# EAGLE design control-bridge (EAGLE 6.6.0)
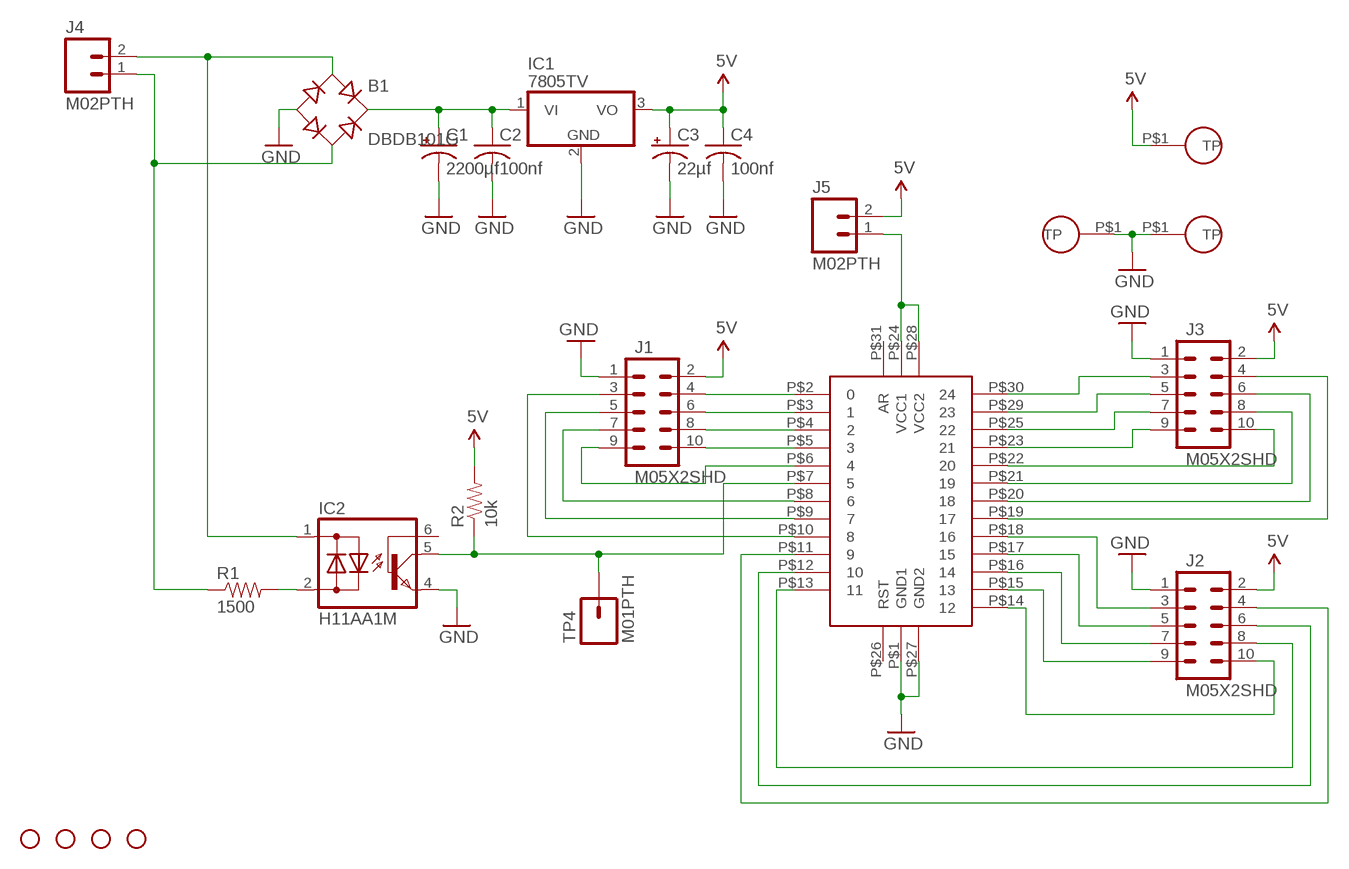
[diagram p0: schematic, sheet 1]

## Parts
B1  DBDB101G  [DB]
C1  2200µf  CPOL-USE5-13  [E5-13]
C2  100nf  C-US025-030X050  [C025-030X050]
C3  22µf  CPOL-USE5-8.5  [E5-8,5]
C4  100nf  C-US025-030X050  [C025-030X050]
IC1  7805TV  [TO220V]
IC2  H11AA1M  [DIL06]
J1  M05X2SHD  [2X5-SHROUDED]
J2  M05X2SHD  [2X5-SHROUDED]
J3  M05X2SHD  [2X5-SHROUDED]
J4  M02PTH  [1X02]
J5  M02PTH  [1X02]
R1  1500  RESISTORPTH-1/4W  [AXIAL-0.4]
R2  10k  RESISTORPTH-1/4W  [AXIAL-0.4]
STANDOFF1  STAND-OFF  [STAND-OFF]
STANDOFF2  STAND-OFF  [STAND-OFF]
STANDOFF3  STAND-OFF  [STAND-OFF]
STANDOFF4  STAND-OFF  [STAND-OFF]
TP1  TP  [TP]
TP2  TP  [TP]
TP3  TP  [TP]
TP4  M01PTH  [1X01]
U1  TEENSY2  [TEENSY2]

## Nets
5V: C3.+ C4.1 IC1.3(VO) J1.2 J2.2 J3.2 J5.2 R2.P$2 TP1.P$1(TP)
GND: B1.- C1.- C2.2 C3.- C4.2 IC1.2(GND) IC2.4(E) J1.1 J2.1 J3.1 TP2.P$1(TP) TP3.P$1(TP) U1.P$1(GND1) U1.P$27(GND2)
N$1: B1.AC2 J4.1 R1.P$1
N$2: B1.AC1 IC2.1(AC1) J4.2
N$3: B1.+ C1.+ C2.1 IC1.1(VI)
N$4: J3.8 U1.P$21
N$5: J3.6 U1.P$20
N$6: J1.4 U1.P$2
N$7: J1.6 U1.P$3
N$8: IC2.5(C) R2.P$1 TP4.1 U1.P$7
N$9: J3.4 U1.P$19
N$10: J2.3 U1.P$18
N$11: J1.8 U1.P$4
N$12: J1.10 U1.P$5
N$13: J5.1 U1.P$24(VCC1) U1.P$28(VCC2)
N$14: IC2.2(AC2) R1.P$2
N$16: J1.9 U1.P$6
N$17: J1.7 U1.P$8
N$19: J2.5 U1.P$17
N$20: J2.7 U1.P$16
N$21: J1.5 U1.P$9
N$22: J1.3 U1.P$10
N$23: J3.3 U1.P$30
N$24: J2.9 U1.P$15
N$25: J2.10 U1.P$14
N$26: J3.5 U1.P$29
N$27: J3.7 U1.P$25
N$28: J3.9 U1.P$23
N$29: J3.10 U1.P$22
N$30: J2.8 U1.P$13
N$31: J2.6 U1.P$12
N$32: J2.4 U1.P$11
Unconnected: IC2.6(B) U1.P$26(RST) U1.P$31(AR)

## Library data of the parts
B1 = rectifier:DB?*G: Single Phase 1.0 AMP Glass Passivated Bridge Rectifier Taiwan Semiconductor Co.,Ltd. - TSC Source: http://www.taiwansemi.com/TSCbig5/ezcatfiles/cust/img/img/db101g.pdf http://www.ts.com.tw/db/pictures/modules/PDT/PDT060207001/DBLS201G.pdf
C1 C3 = adafruit:CPOL-US: POLARIZED CAPACITOR, American symbol
C2 C4 = adafruit:C-US: CAPACITOR, American symbol
IC1 = linear:78*: Positive VOLTAGE REGULATOR Source: http://cache.national.com/ds/LM/LM78L05.pdf http://www.fairchildsemi.com/ds/LM/LM7805.pdf
IC2 = bodger:H11AA1M: Fairchild optocoupler; MF: Fairchild; MPN: H11AA1M; OC_DIGIKEY: H11AA1M-ND
J1-J3 = bodger:M05X2: Header 5x2 Standard 10-pin dual row 0.1" header. Commonly used with AVR-ISP. Use with Spark Fun Electronics SKU: PRT-00778
J4 J5 = SparkFun-Connectors:M02: Standard 2-pin 0.1" header. Use with - straight break away headers ( PRT-00116) - right angle break away headers (PRT-00553) - swiss pins (PRT-00743) - machine pins (PRT-00117) - female headers (PRT-00115) Molex polarized connector foot print use with: PRT-08233 with associated crimp pins and housings. 2.54_SCREWTERM for use with PRT-10571. 3.5mm Screw Terminal footprints for PRT-08084 5mm Screw Terminal footprints for use with PRT-08433
R1 R2 = SparkFun-Passives:RESISTOR: Resistor Basic schematic elements and footprints for 0603, 1206, and PTH resistors.
STANDOFF1-STANDOFF4 = SparkFun-Electromechanical:STAND-OFF: #4 Stand Off This is the mechanical footprint for a #4 phillips button head screw. Use the keepout ring to avoid running the screw head into surrounding components. SKU : PRT-00447
TP1-TP3 = bodger:TP
TP4 = SparkFun-Connectors:M01: Header 1 Standard 1-pin 0.1" header. Use with straight break away headers (SKU : PRT-00116), right angle break away headers (PRT-00553), swiss pins (PRT-00743), machine pins (PRT-00117), and female headers (PRT-00115).
U1 = bodger:TEENSY2

## Board
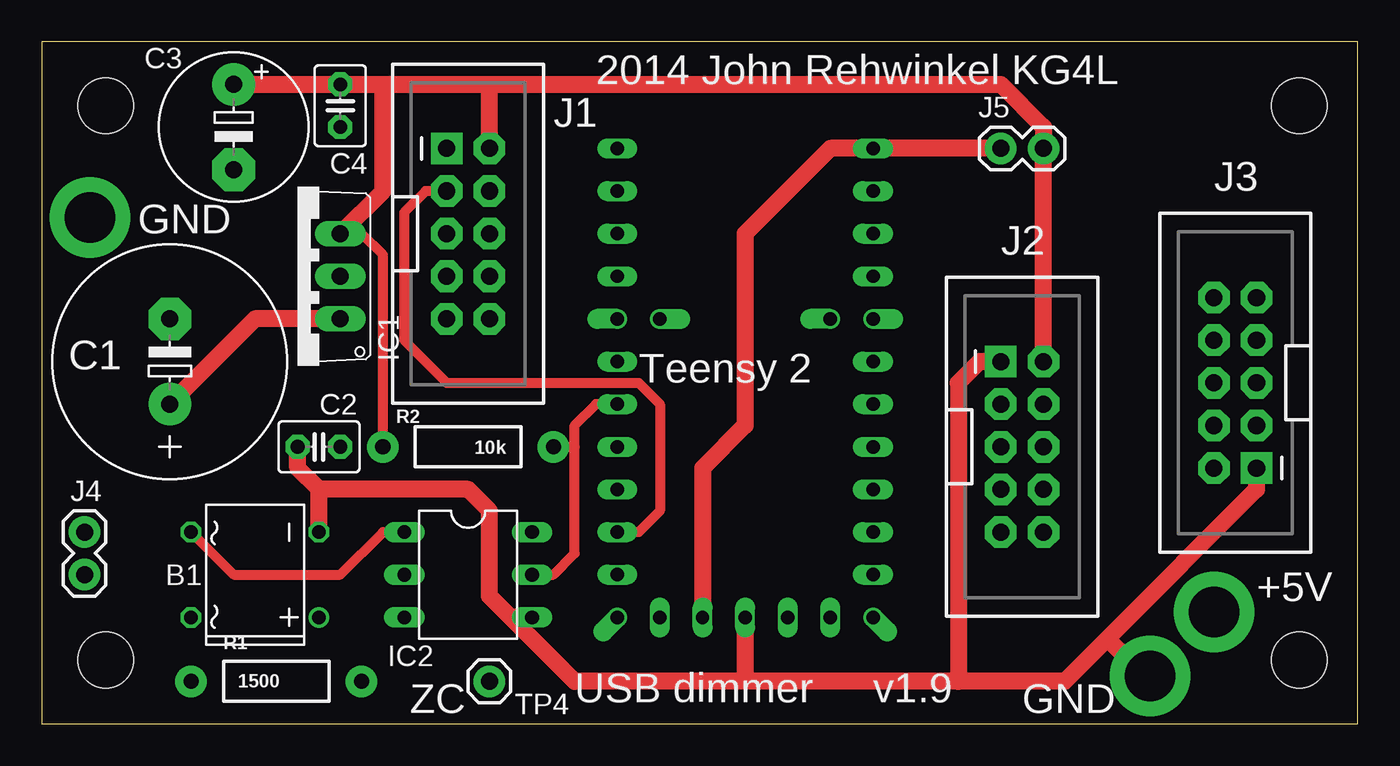
[diagram p1: board, top side]
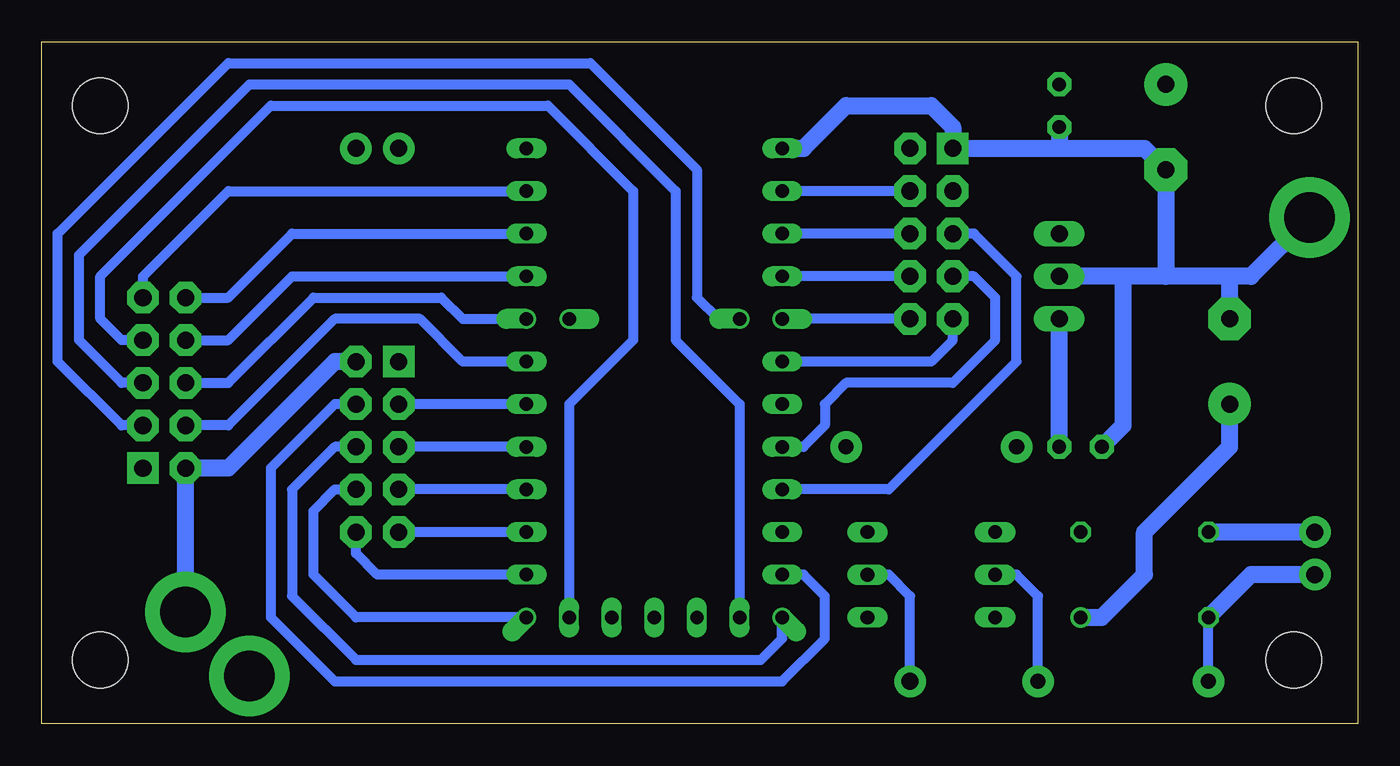
[diagram p2: board, bottom side, seen from below]

Size 78.41 x 40.63 mm. Coordinates in mm from the lower left corner, seen from the top.
Outline: 0,0 78.41,0 78.41,40.63 0,40.63 0,0
Copper layers (1*16): Top 0.0356mm / dielectric 1.5011mm / Bottom 0.0356mm
Design rules "LaenPCBOrder": minimum track width 6mil, minimum drill 13mil, track to track 6mil, track to pad 6mil, pad to pad 6mil, via to via 6mil, smd to smd 6mil, copper to edge 15mil, drill to drill 6mil, minimum pad ring 7mil, minimum via ring 7mil, stop-mask expansion 3mil, vias tented up to drill 0mil, thermal gap 10mil

### Footprints (pad centres in the part's own frame; a part is rotated, then mirrored left to right if it is on the bottom)
DB = drill 0.813: + -2.54,-3.81 | drill 0.813 octagon: - 2.54,-3.81; AC1 2.54,3.81; AC2 -2.54,3.81
E5-13 = drill 1.016 pad 2.54: + -2.54,0 | drill 1.016 pad 2.54 octagon: - 2.54,0
C025-030X050 = drill 0.813 pad 1.422 octagon: 1 -1.27,0; 2 1.27,0
E5-8,5 = drill 1.016 pad 2.54: + -2.54,0 | drill 1.016 pad 2.54 octagon: - 2.54,0
TO220V = drill 1.016 long: 1 -2.54,-2.54; 2 0,-2.54; 3 2.54,-2.54
DIL06 = drill 0.813 long: 1 -2.54,-3.81; 2 0,-3.81; 3 2.54,-3.81; 4 2.54,3.81; 5 0,3.81; 6 -2.54,3.81
2X5-SHROUDED = drill 1.016 pad 1.88 square: 1 -1.27,5.08 | drill 1.016 pad 1.88 octagon: 2 1.27,5.08; 3 -1.27,2.54; 4 1.27,2.54; 5 -1.27,0; 6 1.27,0; 7 -1.27,-2.54; 8 1.27,-2.54; 9 -1.27,-5.08; 10 1.27,-5.08
1X02 = drill 1.016 pad 1.88: 1 0,0; 2 2.54,0
AXIAL-0.4 = drill 0.9 pad 1.88: P$1 -5.08,0; P$2 5.08,0
STAND-OFF = hole 3.302: 0,0
TP = drill 3 pad 4.8: P$1 0,0
1X01 = drill 1.016 pad 1.88: 1 0,0
TEENSY2 = drill 0.8 long: P$1 -7.62,15.24; P$2 -7.62,12.7; P$3 -7.62,10.16; P$4 -7.62,7.62; P$6 -7.62,2.54; P$7 -7.62,0; P$8 -7.62,-2.54; P$9 -7.62,-5.08; P$10 -7.62,-7.62; P$11 -7.62,-10.16; P$14 7.62,-10.16; P$15 7.62,-7.62; P$16 7.62,-5.08; P$17 7.62,-2.54; P$18 7.62,0; P$19 7.62,2.54; P$21 7.62,7.62; P$22 7.62,10.16; P$23 7.62,12.7; P$24 7.62,15.24; P$25 5.08,-12.7; P$26 2.54,-12.7; P$27 0,-12.7; P$28 -2.54,-12.7; P$29 -5.08,-12.7 | drill 0.8 offset: P$5 -7.62,5.08; P$12 -7.62,-12.7; P$13 7.62,-12.7; P$20 7.62,5.08; P$30 -5.08,5.08; P$31 5.08,5.08

### Placement (x,y rotation side)
B1  12.7,8.89 90 top
C1  7.62,21.59 90 top
C2  16.51,16.51 180 top
C3  11.43,35.56 270 top
C4  17.78,36.83 270 top
IC1  15.24,26.67 90 top
IC2  25.4,8.89 270 top
J1  25.4,29.21 0 top
J2  58.42,16.51 0 top
J3  71.12,20.32 180 top
J4  2.54,8.89 90 top
J5  57.15,34.29 0 top
R1  13.97,2.54 0 top
R2  25.4,16.51 180 top
STANDOFF1  3.81,3.81 0 top
STANDOFF2  3.81,36.83 0 top
STANDOFF3  74.93,36.83 0 top
STANDOFF4  74.93,3.81 352.2 top
TP1  69.85,6.67 0 top
TP2  2.86,30.16 0 top
TP3  66.04,2.86 0 top
TP4  26.67,2.54 0 top
U1  41.91,19.05 0 top

### Tracks (layer width: path | path; a pad name or v marks a point on that pad's centre or on a via)
5V
  Top 0.61: R2.P$2 20.32,27.94 19.05,29.21 IC1.3
  Top 1.016: J1.2 26.67,38.1 | J2.2 J5.2 59.69,35.56 57.15,38.1 26.67,38.1 | C3.+ C4.1 20.32,38.1 | IC1.3 20.32,31.75 20.32,38.1 | 20.32,38.1 26.67,38.1
  Bottom 1.016: J2.2 60.96,21.59 67.31,15.24 J3.2 TP1.P$1
GND
  Top 1.016: J3.1 72.39,13.97 63.5,5.08 | 63.5,5.08 60.96,2.54 54.61,2.54 | 54.61,2.54 41.91,2.54 | 41.91,2.54 31.75,2.54 27.94,6.35 | 27.94,6.35 26.67,7.62 26.67,12.7 25.4,13.97 16.51,13.97 | IC2.4 27.94,6.35 | U1.P$27 41.91,2.54 | J2.1 55.88,21.59 54.61,20.32 54.61,2.54 | TP3.P$1 65.72,2.86 63.5,5.08 | B1.- 16.51,13.97 | 16.51,13.97 15.24,15.24 C2.2
  Bottom 1.016: TP2.P$1 6.35,26.67 7.62,26.67 | 7.62,26.67 11.43,26.67 | 11.43,26.67 13.97,26.67 | 13.97,26.67 IC1.2 | C1.- 7.62,26.67 | 11.43,26.67 C3.- 12.7,34.29 17.78,34.29 | 17.78,34.29 J1.1 24.13,35.56 25.4,36.83 30.48,36.83 33.02,34.29 U1.P$1 | C4.2 17.78,34.29 | C2.2 13.97,17.78 13.97,26.67
N$1
  Bottom 0.61: R1.P$1 B1.AC2
  Bottom 1.016: J4.1 6.35,8.89 B1.AC2
N$2
  Top 0.61: B1.AC1 11.43,8.89 17.78,8.89 20.32,11.43 IC2.1
  Bottom 1.016: J4.2 B1.AC1
N$3
  Top 1.016: IC1.1 12.7,24.13 C1.+
  Bottom 1.016: B1.+ 15.24,6.35 12.7,8.89 12.7,11.43 7.62,16.51 C1.+ | C2.1 IC1.1
N$4
  Bottom 0.61: J3.8 67.31,22.86 63.5,26.67 U1.P$21
N$5
  Bottom 0.61: J3.6 67.31,20.32 62.23,25.4 54.61,25.4 53.34,24.13 U1.P$20
N$6
  Bottom 0.61: J1.4 U1.P$2
N$7
  Bottom 0.61: J1.6 U1.P$3
N$8
  Top 0.61: U1.P$7 33.02,19.05 31.75,17.78 31.75,16.51 | IC2.5 30.48,8.89 31.75,10.16 31.75,16.51 | R2.P$1 31.75,16.51
  Bottom 0.61: TP4.1 26.67,7.62 27.94,8.89 IC2.5
N$9
  Bottom 0.61: U1.P$19 53.34,21.59 55.88,24.13 60.96,24.13 67.31,17.78 J3.4
N$10
  Bottom 0.61: U1.P$18 J2.3
N$11
  Bottom 0.61: J1.8 U1.P$4
N$12
  Bottom 0.61: J1.10 U1.P$5
N$13
  Top 1.016: J5.1 U1.P$24 46.99,34.29 41.91,29.21 41.91,17.78 39.37,15.24 U1.P$28
N$14
  Bottom 0.61: R1.P$2 19.05,7.62 20.32,8.89 IC2.2
N$16
  Bottom 0.61: J1.9 24.13,22.86 25.4,21.59 U1.P$6
N$17
  Bottom 0.61: J1.7 22.86,26.67 21.59,25.4 21.59,22.86 24.13,20.32 30.48,20.32 31.75,19.05 31.75,17.78 33.02,16.51 U1.P$8
N$19
  Bottom 0.61: U1.P$17 J2.5
N$20
  Bottom 0.61: U1.P$16 J2.7
N$21
  Bottom 0.61: J1.5 22.86,29.21 20.32,26.67 20.32,21.59 27.94,13.97 U1.P$9
N$22
  Top 0.61: J1.3 22.86,31.75 21.59,30.48 21.59,22.86 24.13,20.32 35.56,20.32 36.83,19.05 36.83,12.7 35.56,11.43 U1.P$10
N$23
  Bottom 0.61: J3.3 73.66,17.78 77.47,21.59 77.47,29.21 67.31,39.37 45.72,39.37 39.37,33.02 39.37,25.4 38.1,24.13 U1.P$30
N$24
  Bottom 0.61: U1.P$15 J2.9
N$25
  Bottom 0.61: U1.P$14 58.42,8.89 59.69,10.16 J2.10
N$26
  Bottom 0.61: J3.5 73.66,20.32 76.2,22.86 76.2,27.94 66.04,38.1 46.99,38.1 40.64,31.75 40.64,22.86 36.83,19.05 U1.P$29
N$27
  Bottom 0.61: J3.7 73.66,22.86 74.93,24.13 74.93,26.67 64.77,36.83 48.26,36.83 43.18,31.75 43.18,22.86 46.99,19.05 U1.P$25
N$28
  Bottom 0.61: J3.9 72.39,26.67 67.31,31.75 U1.P$23
N$29
  Bottom 0.61: J3.10 67.31,25.4 63.5,29.21 U1.P$22
N$30
  Bottom 0.61: U1.P$13 59.69,6.35 62.23,8.89 62.23,12.7 60.96,13.97 J2.8
N$31
  Bottom 0.61: J2.6 60.96,16.51 63.5,13.97 63.5,7.62 59.69,3.81 35.56,3.81 34.29,5.08 U1.P$12
N$32
  Bottom 0.61: J2.4 60.96,19.05 64.77,15.24 64.77,6.35 60.96,2.54 34.29,2.54 31.75,5.08 31.75,7.62 33.02,8.89 U1.P$11

### Text on the board
tPlace: 2014 John Rehwinkel KG4L | J1 | J3 | GND | J2 | Teensy 2 | +5V | USB dimmer | v1.9 | ZC | GND